# Altium schematic sheet Power Supply.SchDoc: Power Supply
size A4; Author: Robbie Smedts; DrawnBy: Robbie Smedts; Engineer: Robbie Smedts; Organization: Thomas More; DocumentNumber: 5; Revision: 0; SheetNumber: 5; SheetTotal: 5; DocumentName: Power Supply
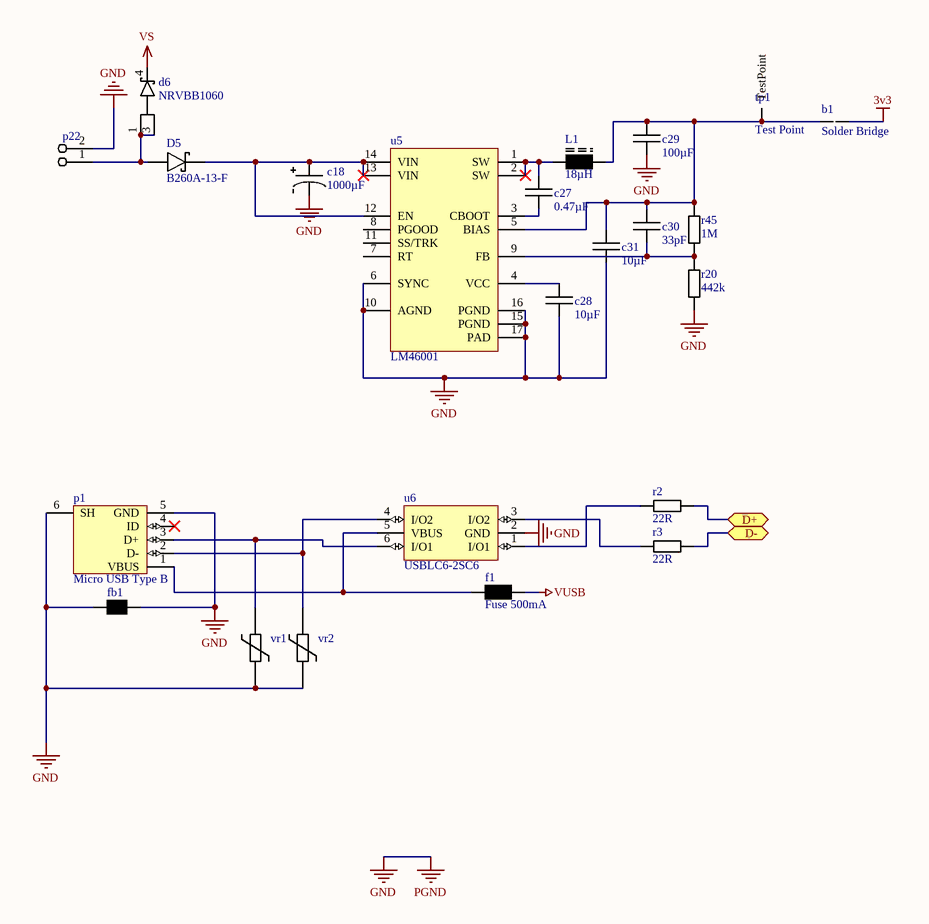
[diagram p0: Power Supply.SchDoc]

## Parts
b1  Solder Bridge  [Solder Bridge]
c18  1000µF  [TH Elco 16]
c27  0.47µF  [0805]
c28  10µF  [0603]
c29  100µF  [1210]
c30  33pF  [0603]
c31  10µF  [0603]
D5  B260A-13-F  [DO-214AB (SMA)]
d6  NRVBB1060  [D²PAK 3]
f1  Fuse 500mA  [PTC Fuses]
fb1  0603 Ferrite Bead  [0603]  (value not drawn)
L1  18µH  [SMD Inductor 7.4x7.4]
p1  Micro USB Type B  [Micro USB Type B]
p22  MKDSN 1.5  [ScrewWtB-2]  (value not drawn)
r2  22R  [0603]
r3  22R  [0603]
r20  442k  [0603]
r45  1M  [0603]
tp1  Test Point  [Test Point]
u5  LM46001  [PWP0016G]
u6  USBLC6-2SC6  [SOT23-6]
vr1  CG0603MLC-05E  [0603]  (value not drawn)
vr2  CG0603MLC-05E  [0603]  (value not drawn)

## Ports
D+ (bidir), D- (bidir)

## Nets
3v3: b1.2
GND: c18.1 c28.1 c29.1 c31.1 fb1.1 fb1.2 p1.5(GND) p1.6(SH) p22.2 r20.1 u5.6(SYNC) u5.10(AGND) u5.15(PGND) u5.16(PGND) u5.17(PAD) u6.2(GND) vr1.1 vr2.1  [also labelled PGND]
SW: u5.2(SW)
Vin: u5.14(Vin)
VS: d6.4
VUSB: f1.2
D+: r2.2 ; port D+
D-: r3.2 ; port D-
Netb1_1: b1.1 c29.2 c30.2 c31.2 L1.2 r45.2 tp1.1(TestPoint) u5.5(BIAS)
Netc18_2: c18.2 D5.1(Kathode) u5.12(EN) u5.13(VIN) u5.14(VIN)
Netc27_1: c27.1 u5.3(CBOOT)
Netc27_2: c27.2 L1.1 u5.1(SW) u5.2(SW)
Netc28_2: c28.2 u5.4(VCC)
Netc30_1: c30.1 r20.2 r45.1 u5.9(FB)
NetD5_2: D5.2(Anode) d6.1 d6.3 p22.1
Netf1_1: f1.1 p1.1(VBUS) u6.5(VBUS)
Netp1_2: p1.2(D-) u6.4(I/O2) vr2.2
Netp1_3: p1.3(D+) u6.6(I/O1) vr1.2
Netr2_1: r2.1 u6.1(I/O1)
Netr3_1: r3.1 u6.3(I/O2)

Not connected (* = marked no-connect by the designer): p1 4(ID)*; u5 7(RT) 8(PGOOD) 11(SS/TRK)

## Notes on the sheet
- Title
- Size:
- Date:
- A4
- Number:
- Time:
- Revision:
- Sheet
- of
- File:

## Library data of the parts
c18 = Elco TH d16: d = 16mm
c27 = 0805 Capacitor: ...F
c28 c30 c31 = 0603 Capacitor: ...F
c29 = 1210 Capacitor: C1210C107M8PACTU
D5 = B260A-13-F: Schottky Rectifier
d6 = NRVBB1060: Schottky Diode 10A
f1 = MF-MSMF Fuse: Style 1
L1 = SRR0735A-180M: Shielded Power Inducor
p1 = Micro USB Type B: SMD
p22 = MKDSN 1.5: Wire-to-board connection
r2 r3 r20 r45 = 0603 Resistor: ...R
u6 = USBLC6-2SC6: SOT23-6 ESD
vr1 vr2 = CG0603MLC-05E: 5V, 8V Varistor - 0603